# Altium schematic sheet can_gateway_v3s_hardwave.SchDoc
size A4
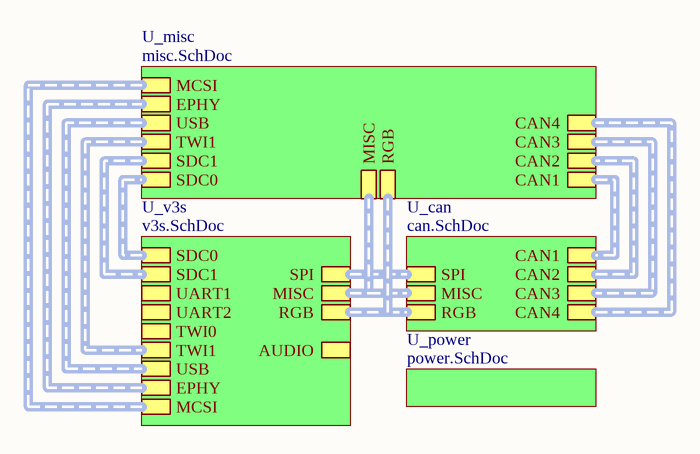
[diagram p0: can_gateway_v3s_hardwave.SchDoc]

## Sub-sheets
U_can = can.SchDoc: SPI (harness SPI), MISC (harness MISC), RGB (harness RGB), CAN4 (harness CAN), CAN3 (harness CAN), CAN2 (harness CAN), CAN1 (harness CAN)
U_misc = misc.SchDoc: SDC0 (harness SDC), CAN4 (harness CAN), CAN3 (harness CAN), CAN2 (harness CAN), CAN1 (harness CAN), EPHY (harness EPHY), USB (harness USB), MISC (harness MISC), SDC1 (harness SDC), RGB (harness RGB), MCSI (harness MCSI), TWI1 (harness TWI)
U_power = power.SchDoc: no entries
U_v3s = v3s.SchDoc: SDC0 (harness SDC), SDC1 (harness SDC), MISC (harness MISC), UART1 (harness UART), UART2 (harness UART), TWI0 (harness TWI), TWI1 (harness TWI), SPI (harness SPI), USB (harness USB), RGB (harness RGB), MCSI (harness MCSI), EPHY (harness EPHY), AUDIO (harness AUDIO)

## Buses and harness runs
harness sheet U_can/CAN1 = sheet U_misc/CAN1
harness sheet U_can/CAN2 = sheet U_misc/CAN2
harness sheet U_can/CAN3 = sheet U_misc/CAN3
harness sheet U_can/CAN4 = sheet U_misc/CAN4
harness sheet U_can/MISC = sheet U_misc/MISC = sheet U_v3s/MISC
harness sheet U_can/RGB = sheet U_misc/RGB = sheet U_v3s/RGB
harness sheet U_can/SPI = sheet U_v3s/SPI
harness sheet U_misc/EPHY = sheet U_v3s/EPHY
harness sheet U_misc/MCSI = sheet U_v3s/MCSI
harness sheet U_misc/SDC0 = sheet U_v3s/SDC0
harness sheet U_misc/SDC1 = sheet U_v3s/SDC1
harness sheet U_misc/TWI1 = sheet U_v3s/TWI1
harness sheet U_misc/USB = sheet U_v3s/USB